# Altium schematic sheet RS485.SchDoc
size A4
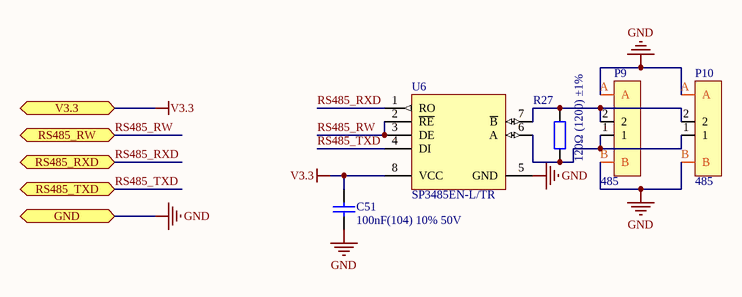
[diagram p0: RS485.SchDoc]

## Parts
C51  100nF(104) 10% 50V  [0805_C]
P9  485  [2P_XH2.54_W]
P10  485  [2P_XH2.54_W]
R27  120Ω (1200) ±1%  [0805_R]
U6  SP3485EN-L/TR  [SOIC-8_150mil]

## Ports
GND, RS485_RW, RS485_RXD, RS485_TXD, V3.3

## Nets
GND: C51.1 P9.A P9.B P10.A P10.B U6.5(GND) ; port GND
V3.3: C51.2 U6.8(VCC) ; port V3.3
RS485_RW: U6.2(~{RE}) U6.3(DE) ; port RS485_RW
RS485_RXD: U6.1(RO) ; port RS485_RXD
RS485_TXD: U6.4(DI) ; port RS485_TXD
NetP9_1: P9.1 P10.1 R27.1 U6.6(A)
NetP9_2: P9.2 P10.2 R27.2 U6.7(~{B})

## Library data of the parts
C51 = 0805 100nF(104) 10% 50V: 贴片电容; ComponentLink1Description: 供应商链接; ComponentLink1URL: http://www.szlcsc.com/product/details_50686.html; Package: 0805; Supplier: LC; SuppliersPartNumber: C49678
P9 P10 = 2P_XH2.54_W
R27 = 0805 120Ω (1200) 1%: 贴片电阻; ComponentLink1Description: 供应商链接; ComponentLink1URL: http://www.szlcsc.com/product/details_18125.html; Package: 0805; Supplier: LC; SuppliersPartNumber: C17437
U6 = SP3485EN-L/TR_[C8963]: RS-485/RS-422; ComponentLink1Description: 供应商链接; ComponentLink1URL: http://www.szlcsc.com/product/details_9482.html; Package: SOIC-8; Supplier: LC; SuppliersPartNumber: C8963